# EAGLE design mlinkxfeed (EAGLE 4.11)
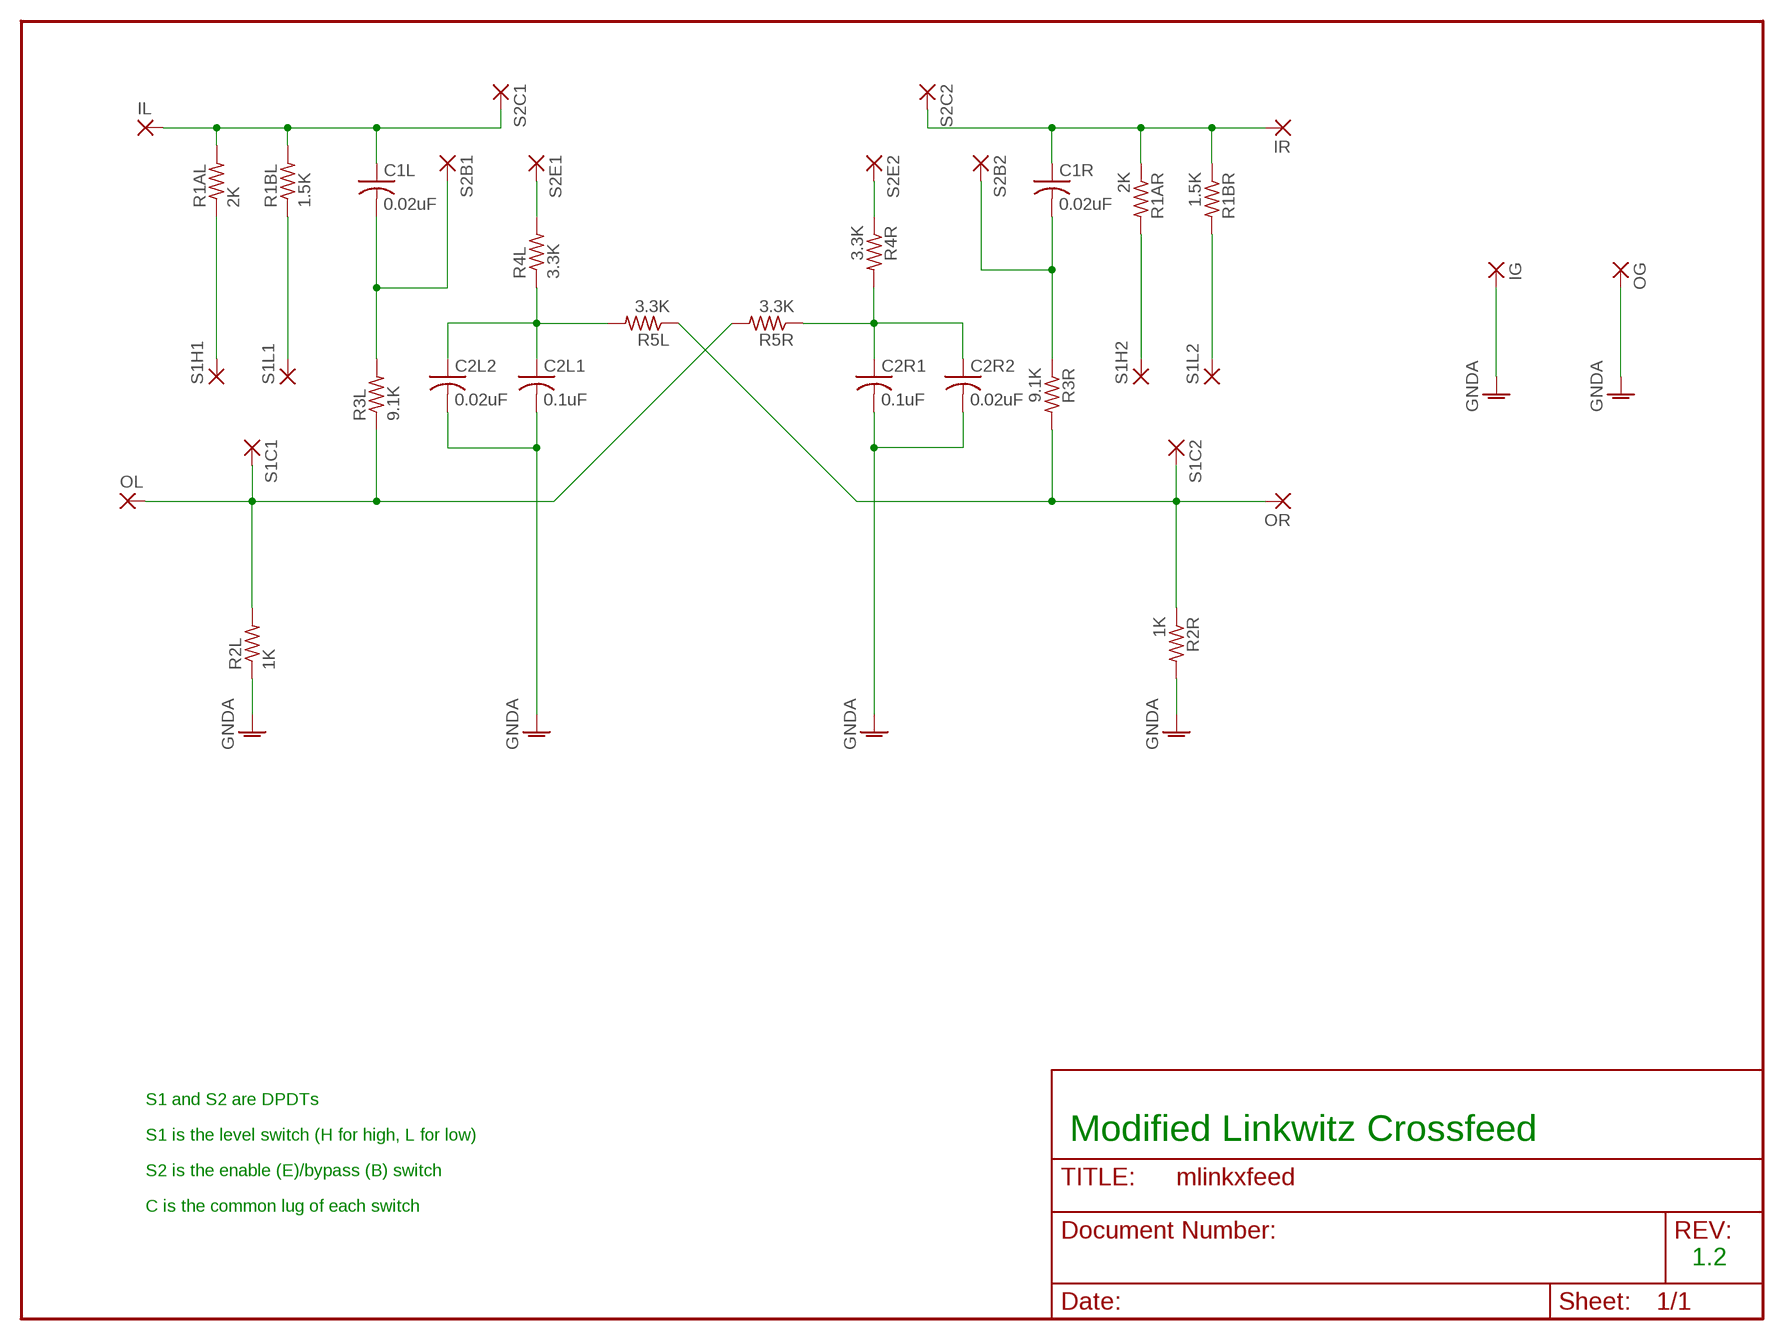
[diagram p0: schematic, sheet 1]

## Parts
C1L  0.02uF  C-US102-054X133  [C102-054X133]
C1R  0.02uF  C-US102-054X133  [C102-054X133]
C2L1  0.1uF  C-US150-072X183  [C150-072X183]
C2L2  0.02uF  C-US102-054X133  [C102-054X133]
C2R1  0.1uF  C-US150-072X183  [C150-072X183]
C2R2  0.02uF  C-US102-054X133  [C102-054X133]
IG  2,15/1,0NOSILK_40  [2,15/1,0_NOSILK_MIL]
IL  2,15/1,0NOSILK_40  [2,15/1,0_NOSILK_MIL]
IR  2,15/1,0NOSILK_40  [2,15/1,0_NOSILK_MIL]
OG  2,15/1,0NOSILK_40  [2,15/1,0_NOSILK_MIL]
OL  2,15/1,0NOSILK_40  [2,15/1,0_NOSILK_MIL]
OR  2,15/1,0NOSILK_40  [2,15/1,0_NOSILK_MIL]
R1AL  2K  R-US_0204/7  [0204/7]
R1AR  2K  R-US_0204/7  [0204/7]
R1BL  1.5K  R-US_0204/7  [0204/7]
R1BR  1.5K  R-US_0204/7  [0204/7]
R2L  1K  R-US_0204/7  [0204/7]
R2R  1K  R-US_0204/7  [0204/7]
R3L  9.1K  R-US_0204/7  [0204/7]
R3R  9.1K  R-US_0204/7  [0204/7]
R4L  3.3K  R-US_0204/7  [0204/7]
R4R  3.3K  R-US_0204/7  [0204/7]
R5L  3.3K  R-US_0204/7  [0204/7]
R5R  3.3K  R-US_0204/7  [0204/7]
S1C1  2,15/1,0NOSILK_40  [2,15/1,0_NOSILK_MIL]
S1C2  2,15/1,0NOSILK_40  [2,15/1,0_NOSILK_MIL]
S1H1  2,15/1,0NOSILK_40  [2,15/1,0_NOSILK_MIL]
S1H2  2,15/1,0NOSILK_40  [2,15/1,0_NOSILK_MIL]
S1L1  2,15/1,0NOSILK_40  [2,15/1,0_NOSILK_MIL]
S1L2  2,15/1,0NOSILK_40  [2,15/1,0_NOSILK_MIL]
S2B1  2,15/1,0NOSILK_40  [2,15/1,0_NOSILK_MIL]
S2B2  2,15/1,0NOSILK_40  [2,15/1,0_NOSILK_MIL]
S2C1  2,15/1,0NOSILK_40  [2,15/1,0_NOSILK_MIL]
S2C2  2,15/1,0NOSILK_40  [2,15/1,0_NOSILK_MIL]
S2E1  2,15/1,0NOSILK_40  [2,15/1,0_NOSILK_MIL]
S2E2  2,15/1,0NOSILK_40  [2,15/1,0_NOSILK_MIL]

## Nets
GNDA: C2L1.2 C2L2.2 C2R1.2 C2R2.2 IG.1(P) OG.1(P) R2L.1 R2R.2
N$1: C1L.1 IL.1(P) R1AL.2 R1BL.2 S2C1.1(P)
N$2: R4L.2 S2E1.1(P)
N$3: C2L1.1 C2L2.1 R4L.1 R5L.2
N$4: C2R1.1 C2R2.1 R4R.2 R5R.1
N$5: C1L.2 R3L.2 S2B1.1(P)
N$6: C1R.2 R3R.1 S2B2.1(P)
N$7: R4R.1 S2E2.1(P)
N$8: C1R.1 IR.1(P) R1AR.1 R1BR.1 S2C2.1(P)
N$10: OR.1(P) R2R.1 R3R.2 R5L.1 S1C2.1(P)
N$11: OL.1(P) R2L.2 R3L.1 R5R.2 S1C1.1(P)
N$17: R1AL.1 S1H1.1(P)
N$18: R1BL.1 S1L1.1(P)
N$19: R1AR.2 S1H2.1(P)
N$20: R1BR.2 S1L2.1(P)

## Notes on the sheet
- S1 and S2 are DPDTs
- S1 is the level switch (H for high, L for low) | Modified Linkwitz Crossfeed
- S2 is the enable (E)/bypass (B) switch
- C is the common lug of each switch
- 1.2

## Library data of the parts
C1L C1R C2L1 C2L2 C2R1 C2R2 = rcl:C-US: CAPACITOR, American symbol
IG IL IR OG OL OR S1C1 S1C2 S1H1 S1H2 S1L1 S1L2 S2B1 S2B2 S2C1 S2C2 S2E1 S2E2 = wirepad:2,15/1,0: THROUGH-HOLE PAD
R1AL R1AR R1BL R1BR R2L R2R R3L R3R R4L R4R R5L R5R = rcl:R-US_: RESISTOR, American symbol

## Net classes
0 default: width 0.635 mm

## Board
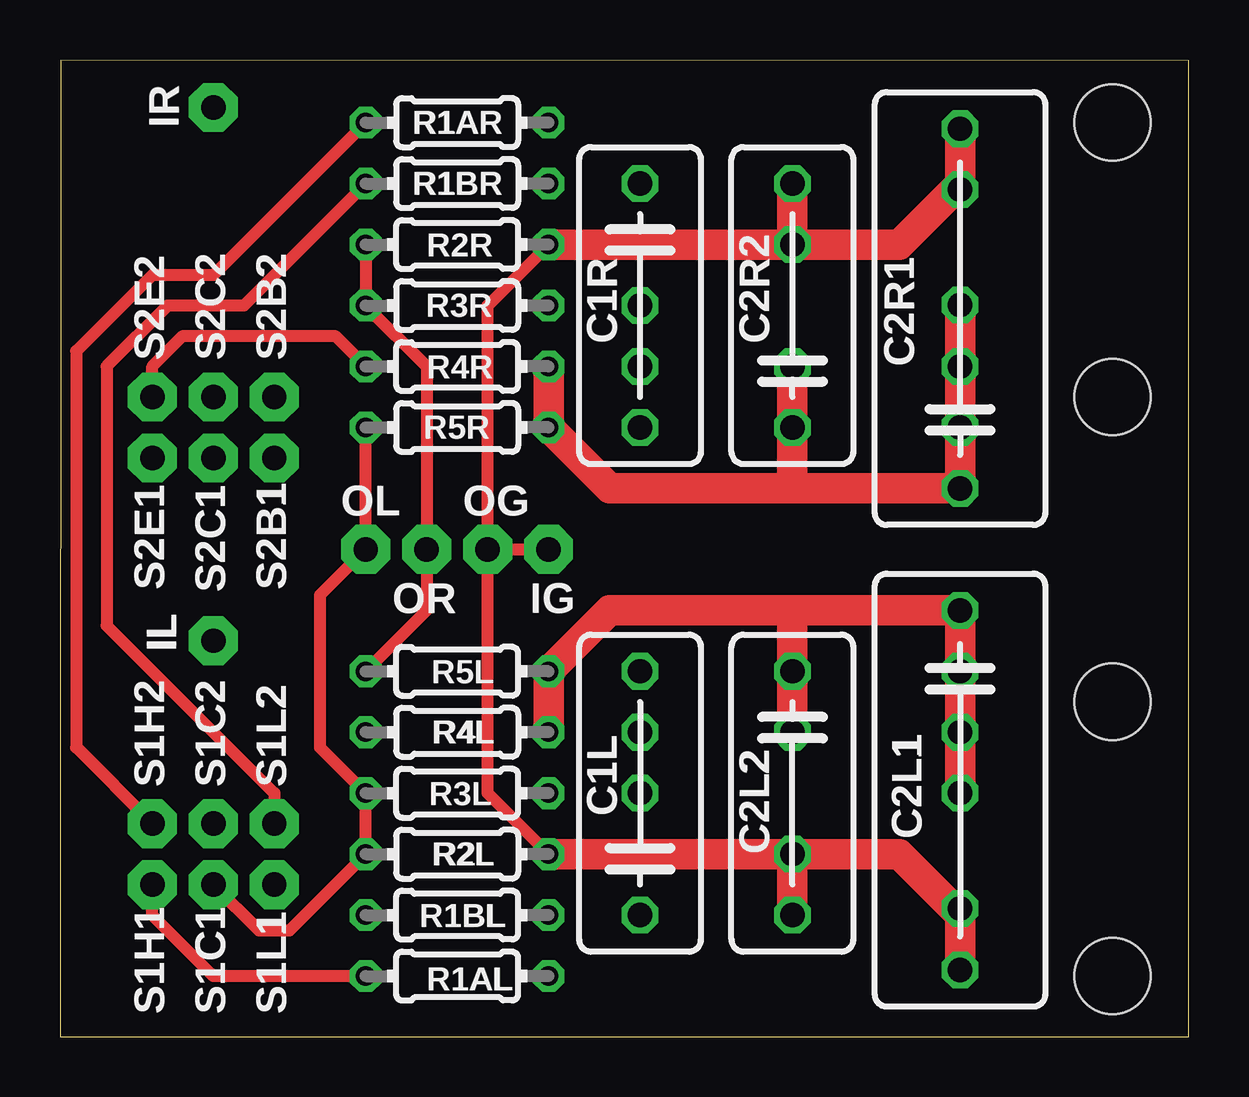
[diagram p1: board, top side]
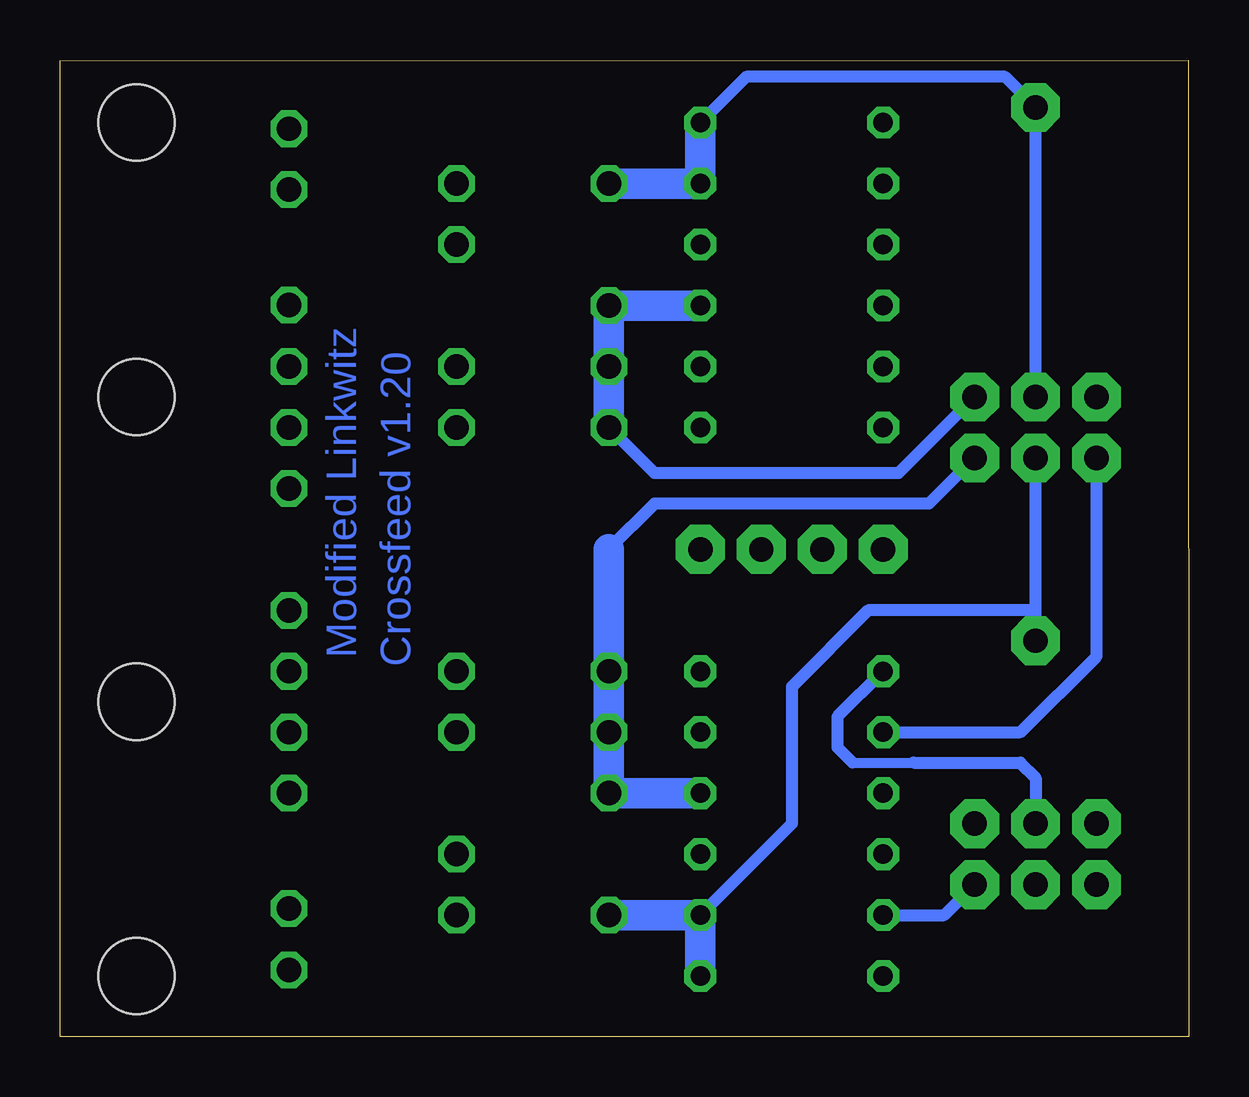
[diagram p2: board, bottom side, seen from below]

Size 47.04 x 40.7 mm. Coordinates in mm from the lower left corner, seen from the top.
Outline: 0,0 47.04,0 47.04,40.68 0.03,40.7 0,0
Copper layers (1*16): Top 0.035mm / dielectric 1.5mm / Bottom 0.035mm
Design rules "default": minimum track width 10mil, minimum drill 24mil, track to track 12mil, track to pad 12mil, pad to pad 12mil, via to via 20mil, smd to smd 10mil, copper to edge 40mil, drill to drill 8mil, minimum pad ring 10mil, minimum via ring 8mil, stop-mask expansion 4mil, vias tented up to drill 0mil, thermal gap 10mil
Holes 3.17 mm at 43.85,2.54 43.85,13.96 43.85,26.67 43.85,38.09

### Footprints (pad centres in the part's own frame; a part is rotated, then mirrored left to right if it is on the bottom)
C102-054X133 = drill 1.016 octagon: 1 -5.08,0; 2 5.08,0
C150-072X183 = drill 1.016 octagon: 1 -7.493,0; 2 7.493,0
2,15/1,0_NOSILK_MIL = drill 1.016 pad 2.032 octagon: 1 0,0
0204/7 = drill 0.813 octagon: 1 -3.81,0; 2 3.81,0

### Placement (x,y rotation side)
C1L  24.17,10.15 90 top
C1R  24.17,30.48 270 top
C2L1  37.5,10.28 270 top
C2L2  30.52,10.15 270 top
C2R1  37.5,30.35 90 top
C2R2  30.52,30.48 90 top
IG  20.36,20.32 180 top
IL  6.39,16.51 90 top
IR  6.39,38.73 0 top
OG  17.82,20.32 270 top
OL  12.74,20.32 270 top
OR  15.28,20.32 90 top
R1AL  16.55,2.54 0 top
R1AR  16.55,38.09 180 top
R1BL  16.55,5.08 0 top
R1BR  16.55,35.55 180 top
R2L  16.55,7.62 180 top
R2R  16.55,33.02 0 top
R3L  16.55,10.15 0 top
R3R  16.55,30.48 180 top
R4L  16.55,12.69 180 top
R4R  16.55,27.94 0 top
R5L  16.55,15.23 0 top
R5R  16.55,25.39 180 top
S1C1  6.39,6.34 90 top
S1C2  6.39,8.88 90 top
S1H1  3.85,6.34 90 top
S1H2  3.85,8.88 90 top
S1L1  8.93,6.34 90 top
S1L2  8.93,8.88 90 top
S2B1  8.93,24.12 90 top
S2B2  8.93,26.67 90 top
S2C1  6.39,24.12 0 top
S2C2  6.39,26.67 180 top
S2E1  3.85,24.12 270 top
S2E2  3.85,26.67 270 top

### Tracks (layer width: path | path; a pad name or v marks a point on that pad's centre or on a via)
GNDA
  Top 0.406: C2R1.2 37.5,38.09 | 37.5,2.54 C2L1.2 | OG.1 IG.1 OG.1
  Top 0.508: R2L.1 17.82,10.15 OG.1 | R2R.2 17.82,30.48 OG.1 | OG.1 IG.1
  Top 1.27: R2R.2 30.52,33.02 | R2L.1 30.52,7.62 | C2R2.2 30.52,33.02 | 30.52,33.02 34.96,33.02 37.5,35.55 C2R1.2 | C2L2.2 30.52,7.62 | 30.52,7.62 34.96,7.62 37.5,5.08 C2L1.2
N$1
  Bottom 0.508: R1BL.2 16.55,8.88 16.55,14.6 13.37,17.78 6.39,17.78 | 6.39,17.78 S2C1.1 | IL.1 6.39,17.78
  Bottom 1.27: C1L.1 R1BL.2 R1AL.2
N$2
  Bottom 0.508: R4L.2 7.02,12.69 3.85,15.87 S2E1.1
N$3
  Top 1.27: R4L.1 R5L.2 22.9,17.78 30.52,17.78 | 30.52,12.69 C2L2.1 30.52,17.78 | 30.52,17.78 C2L1.1 37.5,10.15
N$4
  Top 1.27: 30.52,22.86 22.9,22.86 R5R.1 R4R.2 | 30.52,27.94 C2R2.1 30.52,22.86 | 30.52,22.86 C2R1.1 37.5,30.48
N$5
  Bottom 0.508: S2B1.1 10.83,22.22 22.26,22.22 24.17,20.32
  Bottom 1.27: 24.17,20.32 C1L.2 24.17,10.15 R3L.2
N$6
  Bottom 0.508: S2B2.1 12.1,23.49 22.26,23.49 C1R.2
  Bottom 1.27: C1R.2 24.17,30.48 R3R.1
N$7
  Top 0.508: S2E2.1 3.85,27.94 5.12,29.21 11.47,29.21 R4R.1
N$8
  Bottom 0.508: S2C2.1 IR.1 7.66,40 18.45,40 R1AR.1
  Bottom 1.27: C1R.1 R1BR.1 R1AR.1
N$9  (via drill 1.02 pad 1.42)
  other vias: 24.17,27.94
N$10
  Top 0.508: R2R.1 R3R.2 15.28,27.94 OR.1 15.28,17.78 R5L.1
  Bottom 0.406: 14.01,11.42 11.47,11.42
  Bottom 0.508: R5L.1 14.64,13.33 14.64,12.06 14.01,11.42 | 11.47,11.42 7.02,11.42 6.39,10.79 S1C2.1
N$11
  Top 0.508: R5R.2 OL.1 10.83,18.41 10.83,12.06 R3L.1 R2L.2 9.56,4.44 8.29,4.44 S1C1.1
N$12  (via drill 1.02 pad 1.42)
  other vias: 24.17,30.48
N$13  (via drill 1.02 pad 1.42)
  other vias: 24.17,12.69
N$14  (via drill 1.02 pad 1.42)
  other vias: 24.17,10.15
N$15  (via drill 1.02 pad 1.42)
  other vias: 37.5,15.23
N$16  (via drill 1.02 pad 1.42)
  other vias: 37.5,12.69
N$17
  Top 0.508: R1AL.1 6.39,2.54 3.85,5.08 S1H1.1
N$18
  Bottom 0.508: R1BL.1 10.2,5.08 S1L1.1
N$19
  Top 0.508: R1AR.2 6.39,31.75 3.85,31.75 0.67,28.57 0.67,12.06 S1H2.1
N$20
  Top 0.508: R1BR.2 7.66,30.48 4.48,30.48 1.94,27.94 1.94,17.14 8.93,10.15 S1L2.1
N$21  (via drill 1.02 pad 1.42)
  other vias: 37.5,10.15
N$22  (via drill 1.02 pad 1.42)
  other vias: 37.5,5.35
N$23  (via drill 1.02 pad 1.42)
  other vias: 37.5,25.39
N$24  (via drill 1.02 pad 1.42)
  other vias: 37.5,27.94
N$25  (via drill 1.02 pad 1.42)
  other vias: 37.5,30.5
N$26  (via drill 1.02 pad 1.42)
  other vias: 37.5,35.3
N$27  (via drill 1.02 pad 1.42)
  other vias: 30.52,27.94
N$28  (via drill 1.02 pad 1.42)
  other vias: 30.52,33.02
N$29  (via drill 1.02 pad 1.42)
  other vias: 30.52,7.62
N$30  (via drill 1.02 pad 1.42)
  other vias: 30.52,12.69

### Text on the board
Bottom: Modified Linkwitz | Crossfeed v1.20
_tPlace: R1AR | IR | R1BR | R2R | R3R | C1R | C2R2 | S2E2 | S2C2 | S2B2 | C2R1 | R4R | R5R | OL | OG | S2E1 | S2C1 | S2B1 | OR | IG | IL | R5L | R4L | S1H2 | S1C2 | S1L2 | R3L | C1L | R2L | C2L2 | C2L1 | R1BL | R1AL | S1H1 | S1C1 | S1L1